# Altium schematic sheet PCB2(SMA).SchDoc: ддд
size 594 x 420 mm; CompanyName: АО "Завод ПРОТОН"; DrawnBy: 11; Engineer: 11; Organization: 11; Address1: 11; Address2: 11; Address3: 11; Address4: 11; DocumentNumber: 11; Revision: 111; SheetNumber: 1; SheetTotal: 1; #NAME?: 11; ImagePath: 11; Application_BuildNumber: 11
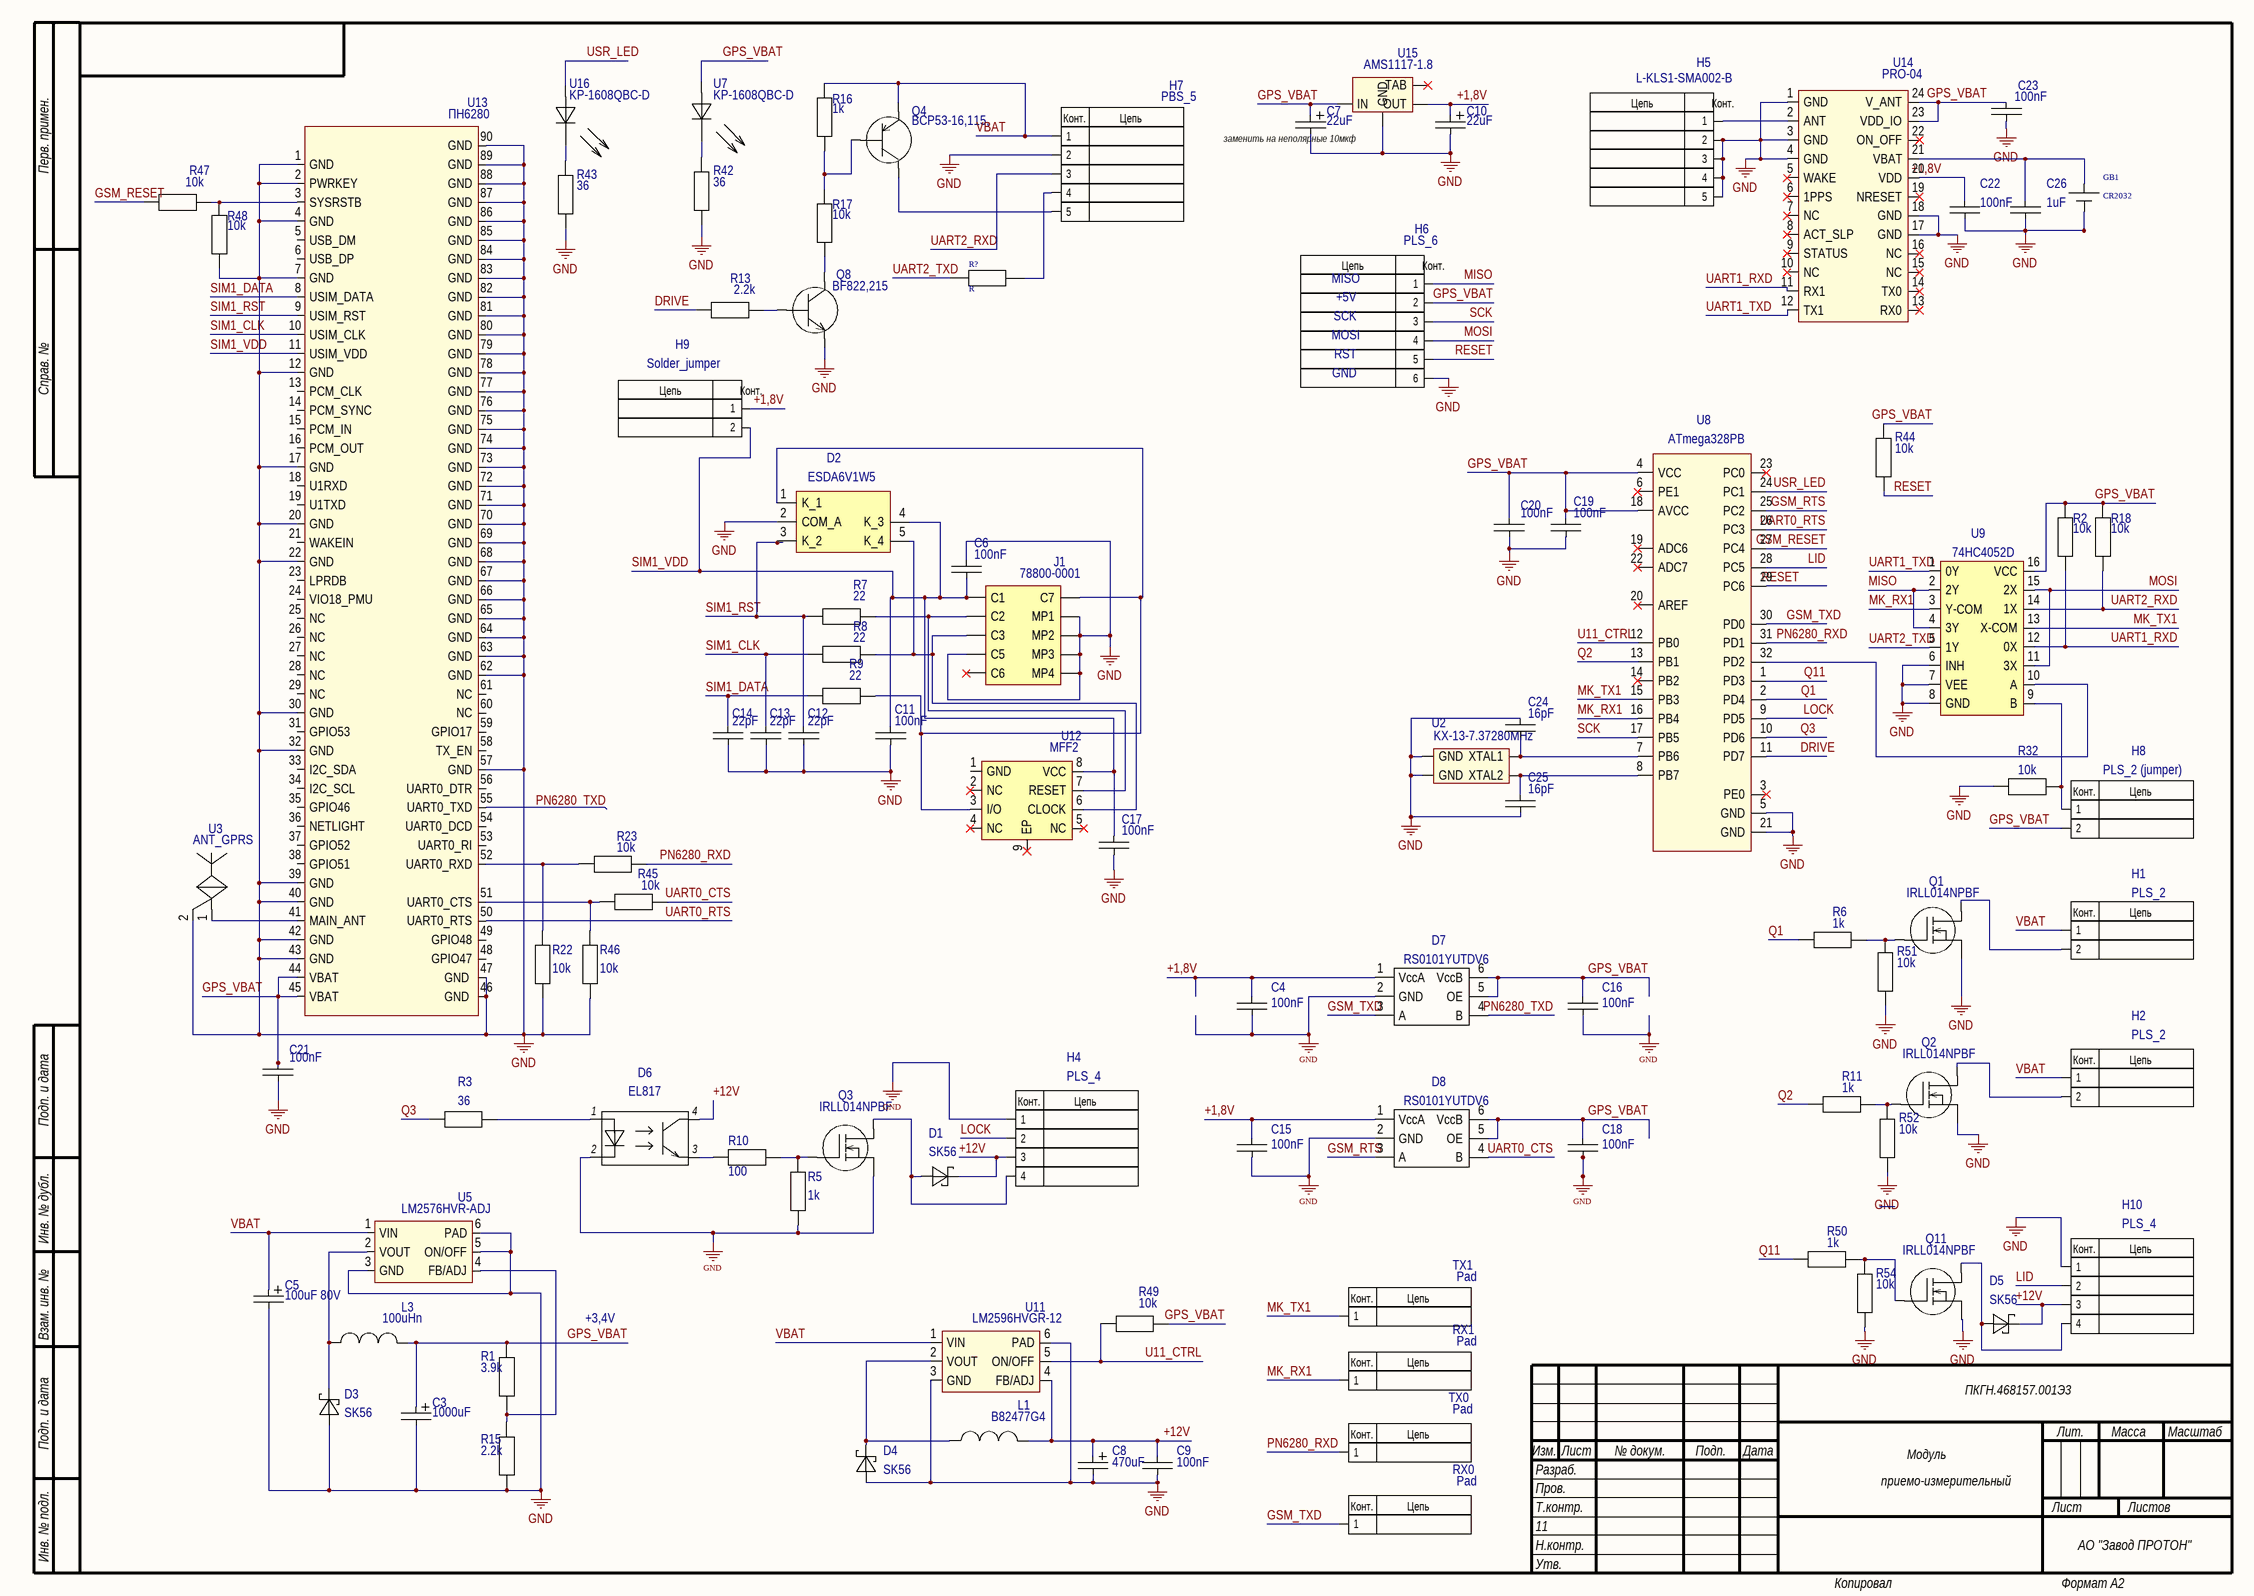
[diagram p0: PCB2(SMA).SchDoc]

## Parts
C3  1000uF  [CP_SMD_BD10.0-L10.3_W10.3-LS11.0]
C4  100nF  [C_0603_(1608)]
C5  100uF 80V  [CP_D12.5_H13.5]
C6  100nF  [CAPC1608X97N]
C7  22uF  [CAPPM3216X180N]
C8  470uF  [CP_SMD_BD10.0-L10.3_W10.3-LS11.0]
C9  100nF  [C_0603_(1608)]
C10  22uF  [CAPPM3216X180N]
C11  100nF  [CAPC1608X97N]
C12  22pF  [CAPC1608X97N]
C13  22pF  [CAPC1608X97N]
C14  22pF  [CAPC1608X97N]
C15  100nF  [C_0603_(1608)]
C16  100nF  [C_0603_(1608)]
C17  100nF  [CAPC1608X97N]
C18  100nF  [C_0603_(1608)]
C19  100nF  [C_0603_(1608)]
C20  100nF  [C_0603_(1608)]
C21  100nF  [C_0603_(1608)]
C22  100nF  [C_0603_(1608)]
C23  100nF  [C_0603_(1608)]
C24  16pF  [CAPC1608X97N]
C25  16pF  [CAPC1608X97N]
C26  1uF  [CAPC2012X145N]
D1  SK56  [DIONM5236X261N]
D2  ESDA6V1W5  [SOT65P210X110-5N]
D3  SK56  [DIONM5236X261N]
D4  SK56  [DIONM5236X261N]
D5  SK56  [DIONM5236X261N]
D6  EL817  [SOP254P1030X390-4N]
D7  RS0101YUTDV6  [DFN1.54x1.0-6L]
D8  RS0101YUTDV6  [DFN1.54x1.0-6L]
GB1  CR2032  [JST-2_1.25]
H1  PLS_2  [PLS-2]
H2  PLS_2  [PLS-2]
H4  PLS_4  [PLS-4]
H5  L-KLS1-SMA002-B  [LKLS1SMA002B]
H6  PLS_6  [PLD-6]
H7  PBS_5  [PBS-5 2.54]
H8  PLS_2 (jumper)  [PLS-2]
H9  Solder_jumper  [Solder_Jumper]
H10  PLS_4  [PLS-4]
J1  78800-0001  [788000001]
L1  B82477G4  [B82477G4]
L3  100uHn  [Inductor_SMD]
Q1  IRLL014NPBF  [SOT-223(BCE)]
Q2  IRLL014NPBF  [SOT-223(BCE)]
Q3  IRLL014NPBF  [SOT-223(BCE)]
Q4  BCP53-16,115,  [SOT-223(BCE)]
Q8  BF822,215  [SOT23-3]
Q11  IRLL014NPBF  [SOT-223(BCE)]
R1  3.9k  [R_0603_(1608)]
R2  10k  [R_0603_(1608)]
R3  36  [R_0603_(1608)]
R5  1k  [R_0603_(1608)]
R6  1k  [R_0603_(1608)]
R7  22  [R_0603_(1608)]
R8  22  [R_0603_(1608)]
R9  22  [R_0603_(1608)]
R10  100  [R_0603_(1608)]
R11  1k  [R_0603_(1608)]
R13  2.2k  [R_0603_(1608)]
R15  2.2k  [R_0603_(1608)]
R16  1k  [R_0603_(1608)]
R17  10k  [R_0603_(1608)]
R18  10k  [R_0603_(1608)]
R22  10k  [R_0603_(1608)]
R23  10k  [R_0603_(1608)]
R32  10k  [R_0603_(1608)]
R42  36  [R_0603_(1608)]
R43  36  [R_0603_(1608)]
R44  10k  [R_0603_(1608)]
R45  10k  [R_0603_(1608)]
R46  10k  [R_0603_(1608)]
R47  10k  [R_0603_(1608)]
R48  10k  [R_0603_(1608)]
R49  10k  [R_0603_(1608)]
R50  1k  [R_0603_(1608)]
R51  10k  [R_0603_(1608)]
R52  10k  [R_0603_(1608)]
R54  10k  [R_0603_(1608)]
R?  R
RX0  Pad  [PAD]
RX1  Pad  [PAD]
TX0  Pad  [PAD]
TX1  Pad  [PAD]
U2  KX-13-7.37280MHz  [XTALL_KX-13]
U3  ANT_GPRS  [ANT_GPRS]
U5  LM2576HVR-ADJ  [TO-263-5]
U7  KP-1608QBC-D  [KP1608QBCD]
U8  ATmega328PB  [QFP80P900X900X120-32N]
U9  74HC4052D  [SOIC127P600X175-16N]
U11  LM2596HVGR-12  [TO-263-5]
U12  MFF2  [SON127P600X500X90-9N-D]
U13  ПН6280  [ПН6280]
U14  PRO-04  [PRO-04_SMD]
U15  AMS1117-1.8  [SOT229P700X180-4N]
U16  KP-1608QBC-D  [KP1608QBCD]

## Nets
GND: C3.2 C4.1 C5.2 C6.2 C7.2 C8.2 C9.1 C10.2 C11.1 C12.1 C13.1 C14.1 C15.1 C16.1 C17.1 C18.1 C19.1 C20.1 C21.1 C22.1 C23.1 C24.2 C25.1 C26.1 D2.2(COM_A) D3.2 D4.2 D6.2 D7.2(GND) D8.2(GND) GB1.2(-) H4.1 H5.2 H5.3 H5.4 H5.5 H6.6 H7.2 H10.1 J1.C5 J1.MP1 J1.MP2 J1.MP3 J1.MP4 Q1.3(S) Q2.3(S) Q3.3(S) Q8.2(E) Q11.3(S) R5.2 R15.1 R22.1 R32.2 R42.1 R43.1 R46.1 R48.1 R51.2 R52.2 R54.2 U2.2(GND) U2.4(GND) U3.2(GND) U5.3(GND) U5.5(ON/OFF) U5.6(PAD) U8.5(GND) U8.21(GND) U9.6(INH) U9.7(VEE) U9.8(GND) U11.3(GND) U11.6(PAD) U13.1(GND) U13.2(PWRKEY) U13.4(GND) U13.7(GND) U13.12(GND) U13.17(GND) U13.20(GND) U13.22(GND) U13.30(GND) U13.32(GND) U13.39(GND) U13.40(GND) U13.42(GND) U13.43(GND) U13.46(GND) U13.47(GND) U13.57(GND) U13.62(GND) U13.63(GND) U13.64(GND) U13.65(GND) U13.66(GND) U13.67(GND) U13.68(GND) U13.69(GND) U13.70(GND) U13.71(GND) U13.72(GND) U13.73(GND) U13.74(GND) U13.75(GND) U13.76(GND) U13.77(GND) U13.78(GND) U13.79(GND) U13.80(GND) U13.81(GND) U13.82(GND) U13.83(GND) U13.84(GND) U13.85(GND) U13.86(GND) U13.87(GND) U13.88(GND) U13.89(GND) U13.90(GND) U14.1(GND) U14.3(GND) U14.4(GND) U14.17(GND) U14.18(GND) U15.1(GND)
+1,8V: C4.2 C10.1 C15.2 C22.2 D7.1(VccA) D8.1(VccA) H9.1 U14.20(VDD) U15.2(OUT)
+12V: C8.1 C9.2 D1.1 D5.1 D6.4 H4.3 H10.3 L1.2 U11.4(FB/ADJ)
DRIVE: R13.1 U8.11(PD7)
GPS_VBAT: C3.1 C7.1 C16.2 C18.2 C19.2 C20.2 C21.2 C23.2 D7.5(OE) D7.6(VccB) D8.5(OE) D8.6(VccB) H6.2 H8.2 L3.2 R1.2 R2.2 R18.2 R44.1 R49.1 U7.1(A) U8.4(VCC) U8.18(AVCC) U9.16(VCC) U13.44(VBAT) U13.45(VBAT) U14.23(VDD_IO) U14.24(V_ANT) U15.3(IN)
GSM_RESET: R47.2 U8.27(PC4)
GSM_RTS: D8.3(A) U8.25(PC2)
GSM_TXD: D7.3(A) RX0.1 U8.30(PD0)
LID: H10.2 U8.28(PC5)
LOCK: H4.2 U8.9(PD5)
MISO: H6.1 U9.2(2Y) U9.4(3Y)
MK_RX1: RX1.1 U8.16(PB4) U9.3(Y-COM)
MK_TX1: TX1.1 U8.15(PB3) U9.13(X-COM)
MOSI: H6.4 U9.11(3X) U9.15(2X)
PN6280_RXD: R23.1 TX0.1 U8.31(PD1)
PN6280_TXD: D7.4(B) U13.55(UART0_TXD)
Q1: R6.2 U8.2(PD4)
Q2: R11.2 U8.13(PB1)
Q3: R3.2 U8.10(PD6)
Q11: R50.2 U8.1(PD3)
RESET: H6.5 R44.2 U8.29(PC6)
SCK: H6.3 U8.17(PB5)
SIM1_CLK: C13.2 R8.2 U13.10(USIM_CLK)
SIM1_DATA: C14.2 R9.2 U13.8(USIM_DATA)
SIM1_RST: C12.2 D2.3(K_2) R7.2 U13.9(USIM_RST)
SIM1_VDD: C6.1 C11.2 C17.2 D2.4(K_3) H9.2 J1.C1 U12.8(VCC) U13.11(USIM_VDD)
U11_CTRL: R49.2 U8.12(PB0) U11.5(ON/OFF)
UART0_CTS: D8.4(B) R45.1
UART0_RTS: U8.26(PC3) U13.50(UART0_RTS)
UART1_RXD: R2.1 U9.12(0X) U14.11(RX1)
UART1_TXD: U9.1(0Y) U14.12(TX1)
UART2_RXD: H7.3 R18.1 U9.14(1X)
UART2_TXD: R?.1 U9.5(1Y)
USR_LED: U8.24(PC1) U16.1(A)
VBAT: C5.1 H1.1 H2.1 H7.1 Q4.3(E) R16.2 U5.1(VIN) U11.1(VIN)
NetC24_1: C24.1 U2.1(XTAL1) U8.7(PB6)
NetC25_2: C25.2 U2.3(XTAL2) U8.8(PB7)
NetC26_2: C26.2 GB1.1(+) U14.21(VBAT)
NetD1_2: D1.2 H4.4 Q3.2(D)
NetD2_1: D2.1(K_1) J1.C7 R9.1 U12.3(I/O)
NetD2_5: D2.5(K_4) J1.C3 R8.1 U12.6(CLOCK)
NetD3_1: D3.1 L3.1 U5.2(VOUT)
NetD4_1: D4.1 L1.1 U11.2(VOUT)
NetD5_2: D5.2 H10.4 Q11.2(D)
NetD6_1: D6.1 R3.1
NetD6_3: D6.3 R10.1
NetH1_2: H1.2 Q1.2(D)
NetH2_2: H2.2 Q2.2(D)
NetH5_1: H5.1 U14.2(ANT)
NetH7_4: H7.4 R?.2
NetH7_5: H7.5 Q4.2(C)
NetH8_1: H8.1 R32.1 U9.9(B)
NetJ1_C2: J1.C2 R7.1 U12.7(RESET)
NetQ1_1: Q1.1(G) R6.1 R51.1
NetQ2_1: Q2.1(G) R11.1 R52.1
NetQ3_1: Q3.1(G) R5.1 R10.2
NetQ4_1: Q4.1(B) R16.1 R17.2
NetQ8_1: Q8.1(B) R13.2
NetQ8_3: Q8.3(C) R17.1
NetQ11_1: Q11.1(G) R50.1 R54.1
NetR1_1: R1.1 R15.2 U5.4(FB/ADJ)
NetR22_2: R22.2 R23.2 U13.52(UART0_RXD)
NetR42_2: R42.2 U7.2(C)
NetR43_2: R43.2 U16.2(C)
NetR45_2: R45.2 R46.2 U13.51(UART0_CTS)
NetR47_1: R47.1 R48.2 U13.3(SYSRSTB)
NetU3_1: U3.1(NET) U13.41(MAIN_ANT)
NetU8_32: U8.32(PD2) U9.10(A)

Not connected (* = marked no-connect by the designer): J1 C6*; U8 3(PE0)* 6(PE1)* 14(PB2)* 19(ADC6)* 20(AREF)* 22(ADC7)* 23(PC0)*; U12 1(GND) 2(NC)* 4(NC)* 5(NC)* 9(EP)*; U13 5(USB_DM) 6(USB_DP) 13(PCM_CLK) 14(PCM_SYNC) 15(PCM_IN) 16(PCM_OUT) 18(U1RXD) 19(U1TXD) 21(WAKEIN) 23(LPRDB) 24(VIO18_PMU) 25(NC) 26(NC) 27(NC) 28(NC) 29(NC) 31(GPIO53) 33(I2C_SDA) 34(I2C_SCL) 35(GPIO46) 36(NETLIGHT) 37(GPIO52) 38(GPIO51) 48(GPIO47) 49(GPIO48) 53(UART0_RI) 54(UART0_DCD) 56(UART0_DTR) 58(TX_EN) 59(GPIO17) 60(NC) 61(NC); U14 5(WAKE)* 6(1PPS)* 7(NC)* 8(ACT_SLP)* 9(STATUS)* 10(NC)* 13(RX0)* 14(TX0)* 15(NC)* 16(NC)* 19(NRESET)* 22(ON_OFF)*; U15 4(TAB)*

## Notes on the sheet
- (near C7) заменить на неполярные 10мкф
- +5V
- MISO
- SCK
- RST
- MOSI
- GND
- +3,4V
- ПКГН.468157.001Э3
- Модуль
- приемо-измерительный
- Перв. примен.
- Справ. №
- Подп. и дата
- Инв. № дубл.
- Взам. инв. №
- Разраб.
- Изм.
- Лист
- № докум.
- Подп.
- Дата
- Лит.
- Масса
- Масштаб
- Пров.
- Т.контр.
- Листов
- Инв. № подл.
- Утв.
- Н.контр.
- Копировал
- Формат А2
- (in symbol Pad) Конт.; Цепь
- (in symbol PLS_2) Конт.; Цепь
- (in symbol PLS_4) Конт.; Цепь
- (in symbol PLS_5) Конт.; Цепь
- (in symbol PLS_6) Цепь; Конт.

## Library data of the parts
C3 C7 C8 C10 = CapPol
C4 C6 C9 C11-C26 = Cap
C5 = CapPol: https://www.chipdip.ru/product0/9000565895
D1 D3-D5 = Schottky: https://www.chipdip.ru/product/sk56
D6 = OPTRONE_NPN: Type: Оптопара транзисторная; Package: *
D7 D8 = RS0101YUTDV6: https://www.chipdip.ru/product0/8011065169; Type: Преобразователь уровней; Package: [DFN1.45x1.0-6L]
GB1 = BATTERY: https://www.chipdip.ru/product0/9000808758 / JST-2 1.25мм
H5 = PLS_5: https://www.chipdip.ru/product/kls1-sma002-b-sma-jr
H7 = PLS_5
H8 H9 = PLS_2
J1 = 78800
L1 L3 = Inductor
Q4 = TRANS-PNP: https://www.chipdip.ru/product/bcp53-16-nxp
Q8 = TRANS-NPN: https://www.chipdip.ru/product/bf822-215
R1-R3 R5-R11 R13 R15-R18 R22 R23 R32 R42-R52 R54 = R
U2 = XTALL_KX-13: https://www.elitan.ru/price/item348176
U3 = ANT_GPRS: PCB_ant
U7 U16 = LED
U15 = AMS1117-3.3: https://www.chipdip.ru/product/ams1117-1.8
R? = R: Type: *; Power dissipation: *; smd size: *; tolerance: *